# Altium schematic sheet audio.SchDoc
size A
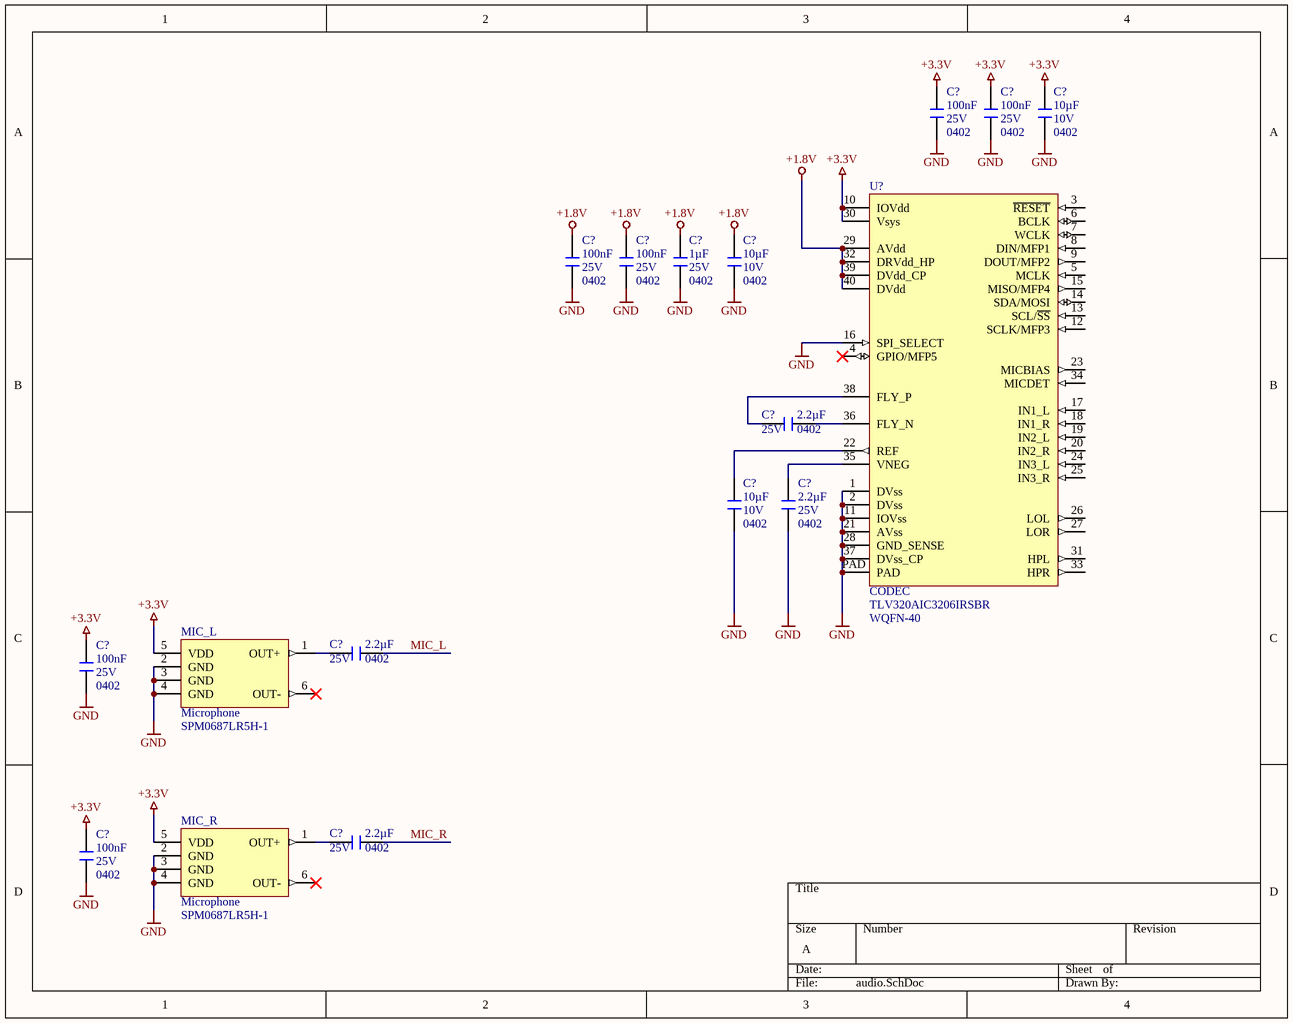
[diagram p0: audio.SchDoc]

## Parts
(Parts that share a designator on the sheet are numbered #1, #2 ... from top to bottom, then left to right.)
C?#1  Case Code (Imperial): 0402  Voltage: 25V  Capacitance: 100nF  [0402_capacitor]  (hidden comment: GRM155R71E104KE14D)
C?#2  Case Code (Imperial): 0402  Voltage: 25V  Capacitance: 100nF  [0402_capacitor]  (hidden comment: GRM155R71E104KE14D)
C?#3  Capacitance: 10µF  Voltage Rating: 10V  Case Code (Imperial): 0402  [0402_capacitor]  (hidden comment: CL05A106MP8NUB8)
C?#4  Case Code (Imperial): 0402  Voltage: 25V  Capacitance: 100nF  [0402_capacitor]  (hidden comment: GRM155R71E104KE14D)
C?#5  Case Code (Imperial): 0402  Voltage: 25V  Capacitance: 100nF  [0402_capacitor]  (hidden comment: GRM155R71E104KE14D)
C?#6  Size Code: 0402  Capacitance: 1µF  Voltage: 25V  [0402_capacitor]  (hidden comment: GRM155R61E105KA12D)
C?#7  Capacitance: 10µF  Voltage Rating: 10V  Case Code (Imperial): 0402  [0402_capacitor]  (hidden comment: CL05A106MP8NUB8)
C?#8  Size Code: 0402  Capacitance: 2.2µF  Rated DC Voltage (URdc): 25V  [0402_capacitor]  (hidden comment: TMK105CBJ225MV-F)
C?#9  Capacitance: 10µF  Voltage Rating: 10V  Case Code (Imperial): 0402  [0402_capacitor]  (hidden comment: CL05A106MP8NUB8)
C?#10  Size Code: 0402  Capacitance: 2.2µF  Rated DC Voltage (URdc): 25V  [0402_capacitor]  (hidden comment: TMK105CBJ225MV-F)
C?#11  Size Code: 0402  Capacitance: 2.2µF  Rated DC Voltage (URdc): 25V  [0402_capacitor]  (hidden comment: TMK105CBJ225MV-F)
C?#12  Case Code (Imperial): 0402  Voltage: 25V  Capacitance: 100nF  [0402_capacitor]  (hidden comment: GRM155R71E104KE14D)
C?#13  Size Code: 0402  Capacitance: 2.2µF  Rated DC Voltage (URdc): 25V  [0402_capacitor]  (hidden comment: TMK105CBJ225MV-F)
C?#14  Case Code (Imperial): 0402  Voltage: 25V  Capacitance: 100nF  [0402_capacitor]  (hidden comment: GRM155R71E104KE14D)
MIC_L  Microphone  [SPM0687LR5H-1]
MIC_R  Microphone  [SPM0687LR5H-1]
U?  CODEC  Package: WQFN-40  [QFN-40]

## Nets
+1.8V: C?#4.2 C?#5.2 C?#6.2 C?#7.2 U?.29(AVdd) U?.32(DRVdd_HP) U?.39(DVdd_CP) U?.40(DVdd)
+3.3V: C?#1.2 C?#2.2 C?#3.2 C?#12.2 C?#14.2 MIC_L.5(VDD) MIC_R.5(VDD) U?.10(IOVdd) U?.30(Vsys)
GND: C?#1.1 C?#2.1 C?#3.1 C?#4.1 C?#5.1 C?#6.1 C?#7.1 C?#9.1 C?#10.1 C?#12.1 C?#14.1 MIC_L.2(GND) MIC_L.3(GND) MIC_L.4(GND) MIC_R.2(GND) MIC_R.3(GND) MIC_R.4(GND) U?.1(DVss) U?.2(DVss) U?.11(IOVss) U?.16(SPI_SELECT) U?.21(AVss) U?.28(GND_SENSE) U?.37(DVss_CP) U?.PAD
MIC_L: C?#11.2
MIC_R: C?#13.2
NetC?#8_1: C?#8.1 U?.38(FLY_P)
NetC?#8_2: C?#8.2 U?.36(FLY_N)
NetC?#9_2: C?#9.2 U?.22(REF)
NetC?#10_2: C?#10.2 U?.35(VNEG)
NetC?#11_1: C?#11.1 MIC_L.1(OUT+)
NetC?#13_1: C?#13.1 MIC_R.1(OUT+)

Not connected (* = marked no-connect by the designer): MIC_L 6(OUT-)*; MIC_R 6(OUT-)*; U? 3(~{RESET}) 4(GPIO/MFP5)* 5(MCLK) 6(BCLK) 7(WCLK) 8(DIN/MFP1) 9(DOUT/MFP2) 12(SCLK/MFP3) 13(SCL/~{SS}) 14(SDA/MOSI) 15(MISO/MFP4) 17(IN1_L) 18(IN1_R) 19(IN2_L) 20(IN2_R) 23(MICBIAS) 24(IN3_L) 25(IN3_R) 26(LOL) 27(LOR) 31(HPL) 33(HPR) 34(MICDET)

## Library data of the parts
C?#1 C?#2 C?#4 C?#5 C?#12 C?#14 = GRM155R71E104KE14D: 100 nF, 25 V, X7R, 0402 Chip capacitor; Manufacturer: Murata; Dielectric Material: Ceramic; Tolerance: 10%; Supplier 1: Digi-Key; Supplier Part Number 1: 490-10698-1-ND; RoHS: Yes; Category: Ceramic Capacitors; Pricing 1: 1=0.10000, 10=0.02700, 50=0.01460, 100=0.01190, 500=0.00848, 1000=0.00666, 2500=0.00605, 5000=0.00557 (USD); Mount: Surface Mount; Case/Package: 0402; Case Code (Metric): 1005; Weight: 0.000212oz; Min Operating Temperature: -55°C; Max Operating Temperature: 125°C; Packaging: Tape and Reel; Voltage Rating: 25V; Dielectric: X7R; Termination: SMD/SMT; Resistor Type: Ceramic; Voltage Rating (DC): 25V; Package Quantity: 10000; Length: 1mm; Width: 0.02inch; Height: 0.5mm; Thickness: 0.022inch; Depth: 0.5mm; REACH SVHC: Unknown; Lead Free: Lead Free; RoHS Compliant: Yes; ComponentLink1URL: http://www.farnell.com/datasheets/1872206.pdf?src-supplier=Farnell; ComponentLink1Description: http://www.farnell.com/datasheets/1872206.pdf?src-supplier=Farnell; ComponentLink2URL: http://components.arrow.com/part/dataview/0323_06361249?src-supplier=Arrow+Europe; ComponentLink2Description: http://components.arrow.com/part/dataview/0323_06361249?src-supplier=Arrow+Europe; ComponentLink3URL: http://uk.rs-online.com/webdocs/144c/0900766b8144c113.pdf?src-supplier=RSComponents; ComponentLink3Description: http://uk.rs-online.com/webdocs/144c/0900766b8144c113.pdf?src-supplier=RSComponents; ComponentLink4URL: http://www.farnell.com/datasheets/2048008.pdf?src-supplier=Farnell; ComponentLink4Description: http://www.farnell.com/datasheets/2048008.pdf?src-supplier=Farnell; ComponentLink5URL: http://www.mouser.com/ds/2/281/c02e-2905.pdf?src-supplier=Mouser; ComponentLink5Description: http://www.mouser.com/ds/2/281/c02e-2905.pdf?src-supplier=Mouser; ComponentLink6URL: http://www.farnell.com/datasheets/2048008.pdf?src-supplier=Newark; ComponentLink6Description: http://www.farnell.com/datasheets/2048008.pdf?src-supplier=Newark; ComponentLink7URL: https://search.murata.co.jp/Ceramy/image/img/A01X/G101/ENG/GRM155R71E104KE14-01.pdf?src-supplier=Digi-Key; ComponentLink7Description: https://search.murata.co.jp/Ceramy/image/img/A01X/G101/ENG/GRM155R71E104KE14-01.pdf?src-supplier=Digi-Key; ComponentLink8URL: http://www.farnell.com/datasheets/2048008.pdf?src-supplier=Element14; ComponentLink8Description: http://www.farnell.com/datasheets/2048008.pdf?src-supplier=Element14; ComponentLink9URL: http://psearch.en.murata.com/capacitor/product/GRM155R71E104KE14%23.pdf?src-supplier=Avnet; ComponentLink9Description: http://psearch.en.murata.com/capacitor/product/GRM155R71E104KE14%23.pdf?src-supplier=Avnet; Manufacturer Part Number: GRM155R71E104KE14D
C?#3 C?#7 C?#9 = CL05A106MP8NUB8: 10 µF, 10 V, X5R, 0402 Chip capacitor; Manufacturer: Samsung; Tolerance: 20%; Supplier 1: Digi-Key; Supplier Part Number 1: 1276-6830-1-ND; RoHS: Yes; Category: Ceramic Capacitors; Stock 1: 740658; Pricing 1: 1=0.36000, 10=0.25300, 50=0.17720, 100=0.15180, 500=0.11384, 1000=0.09614, 2500=0.09108 (USD); Mount: Surface Mount; Case/Package: 0402; Case Code (Metric): 1005; Min Operating Temperature: -55°C; Max Operating Temperature: 85°C; Packaging: Tape and Reel; Length: 0.039inch; Width: 0.02inch; Thickness: 0.035inch; RoHS Compliant: Yes; ComponentLink1URL: http://www.samsungsem.com/kr/support/product-search/mlcc/CL05A106MP8NUB8.jsp?src-supplier=Digi-Key; ComponentLink1Description: http://www.samsungsem.com/kr/support/product-search/mlcc/CL05A106MP8NUB8.jsp?src-supplier=Digi-Key; Manufacturer Part Number: CL05A106MP8NUB8
C?#6 = GRM155R61E105KA12D: 1 µF, 25 V, X5R, 0402 Chip capacitor; Manufacturer: Murata; Dielectric Material: Ceramic; Multilayer: Yes; Negative Tolerance: 10%; Supplier 1: Digi-Key; Supplier Part Number 1: 490-10017-1-ND; RoHS: Yes; Category: Ceramic Capacitors; Stock 1: 145965; Pricing 1: 1=0.11000, 10=0.08300, 50=0.04560, 100=0.03720, 500=0.02656, 1000=0.02087, 2500=0.01898, 5000=0.01746 (USD); Mount: Surface Mount; Number of Pins: 2; Package Shape: Rectangular; Terminal Finish: Nickel; Min Operating Temperature: -55°C; Max Operating Temperature: 85°C; JESD-609 Code: e3; Capacitor Type: Ceramic; Package Style: SMTMeter; Packaging: Tape and Reel; Positive Tolerance: 10%; Temperature Characteristics Code: X5R; Termination: Wraparound; Length: 1mm; Width: 0.5mm; Height: 0.5mm; REACH SVHC: Yes; RoHS Compliant: Yes; ComponentLink1URL: https://datasheet.ciiva.com:443/pdfs/VipMasterIC/IC/MURE/MURE-S-A0004362469/MURE-S-A0004364524-1.pdf?src-supplier=IHS+Markit; ComponentLink1Description: https://datasheet.ciiva.com:443/pdfs/VipMasterIC/IC/MURE/MURE-S-A0004362469/MURE-S-A0004364524-1.pdf?src-supplier=IHS+Markit; ComponentLink2URL: https://datasheet.ciiva.com/7719/1666664-7719006.pdf?src-supplier=Element14; ComponentLink2Description: https://datasheet.ciiva.com/7719/1666664-7719006.pdf?src-supplier=Element14; ComponentLink3URL: https://datasheet.ciiva.com/22732/1666664-22732122.pdf?src-supplier=Element14; ComponentLink3Description: https://datasheet.ciiva.com/22732/1666664-22732122.pdf?src-supplier=Element14; Manufacturer Part Number: GRM155R61E105KA12D
C?#8 C?#10 C?#11 C?#13 = TMK105CBJ225MV-F: 2.2 µF, 25 V, X5R, 0402 Chip Capacitor; Manufacturer: Taiyo Yuden; Dielectric Material: Ceramic; Multilayer: Yes; Negative Tolerance: 20%; Supplier 1: Digi-Key; Supplier Part Number 1: 587-6022-1-ND; RoHS: Yes; Category: Ceramic Capacitors; Stock 1: 6102; Pricing 1: 1=0.22000, 10=0.15600, 50=0.08880, 100=0.07350, 500=0.05156, 1000=0.04269, 2500=0.03973, 5000=0.03635 (USD); Mount: Surface Mount; Number of Pins: 2; Package Shape: Rectangular; Min Operating Temperature: -55°C; Max Operating Temperature: 85°C; Capacitor Type: Ceramic; Package Style: SMTMeter; Packaging: Tape and Reel; Positive Tolerance: 20%; Temperature Characteristics Code: X5R; Termination: Wraparound; Length: 1mm; Width: 0.5mm; Height: 0.5mm; REACH SVHC: Yes; RoHS Compliant: Yes; ComponentLink1URL: https://datasheet.ciiva.com:443/pdfs/VipMasterIC/IC/TAIY/TAIY-S-A0009103435/TAIY-S-A0009102688-1.pdf?src-supplier=IHS+Markit; ComponentLink1Description: https://datasheet.ciiva.com:443/pdfs/VipMasterIC/IC/TAIY/TAIY-S-A0009103435/TAIY-S-A0009102688-1.pdf?src-supplier=IHS+Markit; ComponentLink2URL: https://ds.yuden.co.jp/TYCOMPAS/ut/detail?pn=TMK105CBJ225MV-F &amp;u=M&src-supplier=Digi-Key; ComponentLink2Description: https://ds.yuden.co.jp/TYCOMPAS/ut/detail?pn=TMK105CBJ225MV-F &amp;u=M&src-supplier=Digi-Key; ComponentLink3URL: http://ds.yuden.co.jp/TYCOMPAS/ut/detail.do?productNo=TMK105CBJ225MV-F&amp;fileName=TMK105CBJ225MV-F_SS&amp;mode=specSheetDownload&src-supplier=Digi-Key; ComponentLink3Description: http://ds.yuden.co.jp/TYCOMPAS/ut/detail.do?productNo=TMK105CBJ225MV-F&amp;fileName=TMK105CBJ225MV-F_SS&amp;mode=specSheetDownload&src-supplier=Digi-Key; Manufacturer Part Number: TMK105CBJ225MV-F
MIC_L MIC_R = SPM0687LR5H-1: Analog MEMS microphone; Manufacturer: Knowles; Shape: Rectangular; Operating Supply Current: 285uA; Supplier 1: Digi-Key; Stock 1: 8303; Pricing 1: 1=1.91, 10=1.589, 25=1.4692, 50=1.3814, 100=1.297, 500=1.1134, 1000=1.0628 (USD); Output Type: Analog; Packaging: Cut Tape; Termination: Solder; ComponentLink1URL: https://media.digikey.com/pdf/Data%20Sheets/Knowles%20Acoustics%20PDFs/SPM0687LR5H-1.pdf?src-supplier=Digi-Key; ComponentLink1Description: https://media.digikey.com/pdf/Data%20Sheets/Knowles%20Acoustics%20PDFs/SPM0687LR5H-1.pdf?src-supplier=Digi-Key; ComponentLink2URL: https://media.digikey.com/pdf/Data%20Sheets/Knowles%20Acoustics%20PDFs/SPM0687LR5H-1_DS.pdf?src-supplier=Digi-Key; ComponentLink2Description: https://media.digikey.com/pdf/Data%20Sheets/Knowles%20Acoustics%20PDFs/SPM0687LR5H-1_DS.pdf?src-supplier=Digi-Key; Supplier Part Number 1: 423-1427-1-ND; Manufacturer Part Number: SPM0687LR5H-1
U? = TLV320AIC3206IRSBR: Stereo audio CODEC, WQFN-40; Manufacturer: Texas Instruments; Interface: I2C,SPI,Serial,I2S,2-Wire; Operating Supply Voltage: 1.8V; Max Supply Voltage: 1.95V; Resolution: 32b; Number of A/D Converters: 2; Sampling Rate: 192KS/s; Signal to Noise Ratio (SNR): 93dB; Power Consumption: 5mW; Number of Analog Inputs: 6; Number of Analog Outputs: 4; Supplier 1: Digi-Key; Stock 1: 2633; Pricing 1: 1=6.12, 10=5.495, 25=5.1944, 100=4.5019, 250=4.271, 500=3.8324, 1000=3.6373 (USD); Mount: Surface Mount; Number of Pins: 40; Min Operating Temperature: -40°C; Max Operating Temperature: 85°C; Package Quantity: 3000; Packaging: Tape and Reel; Number of D/A Converters: 2; Number of ADC Channels: 2; Number of DAC Channels: 2; Type: General Purpose; Series: PowerTune™; Radiation Hardening: No; Lead Free: Lead Free; RoHS Compliant: Yes; ComponentLink1URL: http://www.ti.com/lit/ds/symlink/tlv320aic3206.pdf?src-supplier=Digi-Key; ComponentLink1Description: http://www.ti.com/lit/ds/symlink/tlv320aic3206.pdf?src-supplier=Digi-Key; Supplier Part Number 1: 296-41705-1-ND; Manufacturer Part Number: TLV320AIC3206IRSBR